# Altium schematic sheet ST-Link Stlink v2_02.SchDoc
size A4
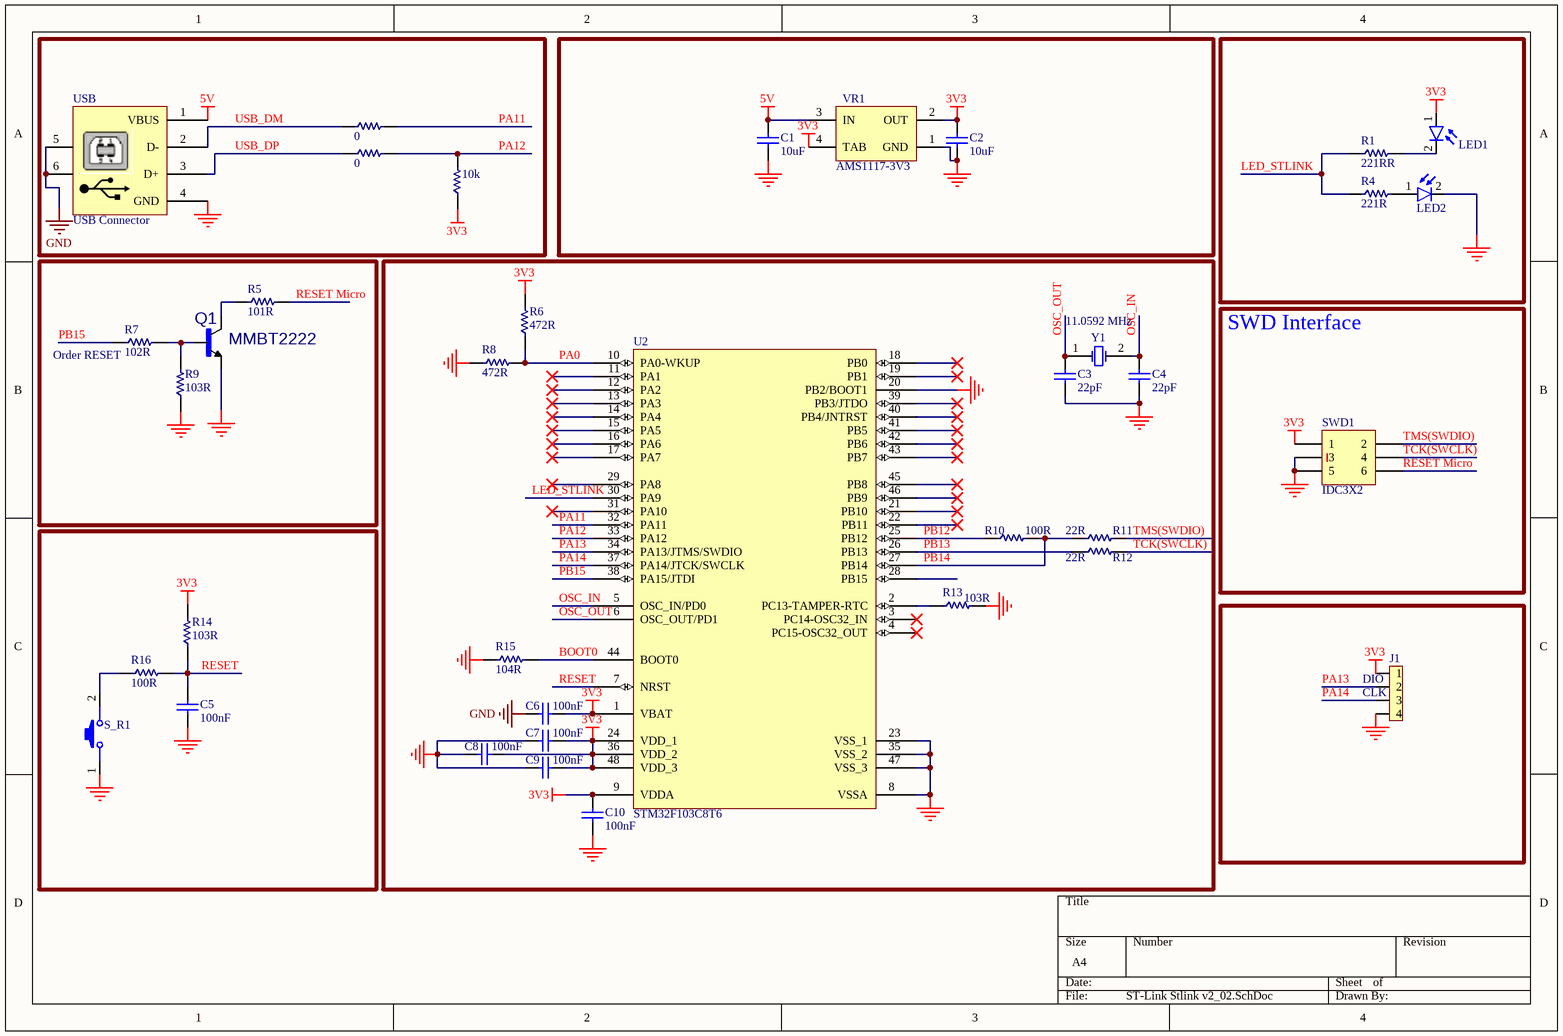
[diagram p0: ST-Link Stlink v2_02.SchDoc]

## Parts
C1  10uF  [CAPC4817X12N]
C2  10uF  [CAPC4817X12N]
C3  22pF  [CAPC4817X12N]
C4  22pF  [CAPC4817X12N]
C5  100nF  [CAPC4817X12N]
C6  100nF  [CAPC4817X12N]
C7  100nF  [CAPC4817X12N]
C8  100nF  [CAPC4817X12N]
C9  100nF  [CAPC4817X12N]
C10  100nF  [CAPC4817X12N]
J1  Program Chip  [ZSIP04]  (value not drawn)
LED1  Color  [LED SMD 1206]  (value not drawn)
LED2  Color  [LED SMD 1206]  (value not drawn)
Q1  MMBT2222  [SOT23_BEC_M]
R1  221RR  [RES1206]
R2  10k  [RES1206]
R4  221R  [RES1206]
R5  101R  [RES1206]
R6  472R  [RES1206]
R7  102R  [RES1206]
R8  472R  [RES1206]
R9  103R  [RES1206]
R10  100R  [RES1206]
R11  22R  [RES1206]
R12  22R  [RES1206]
R13  103R  [RES1206]
R14  103R  [RES1206]
R15  104R  [RES1206]
R16  100R  [RES1206]
R20  0  [RES1206]
R21  0  [RES1206]
S_R1  SW4  [SMD_ALPS_NEW]  (value not drawn)
SWD1  IDC3X2  [IDC_2X3]
U2  STM32F103C8T6  [LQFP48_M]
USB  USB Connector  [USB2.5-2H4F]
VR1  AMS1117-3V3  [MP04A_N]
Y1  11.0592 MHz  [Crystal SMD]

## Blocks framed on the sheet
Order RESET: Q1 R5 R7 R9
SWD Interface: SWD1

## Nets
3V3: C2.2 C6.1 C7.1 C8.1 C9.1 C10.2 J1.1 LED1.1(A) R2.1 R6.2 R14.2 SWD1.1 U2.1(VBAT) U2.9(VDDA) U2.24(VDD_1) U2.36(VDD_2) U2.48(VDD_3) VR1.2(OUT) VR1.4(TAB)
5V: C1.2 USB.1(VBUS) VR1.3(IN)
GND: C1.1 C2.1 C3.1 C4.1 C5.1 C6.2 C7.2 C8.2 C9.2 C10.1 J1.4 LED2.2(K) Q1.2(E) R8.1 R9.1 R13.2 R15.1 S_R1.1(Button) SWD1.3 SWD1.5 U2.8(VSSA) U2.20(PB2/BOOT1) U2.23(VSS_1) U2.35(VSS_2) U2.47(VSS_3) USB.4(GND) USB.5 USB.6 VR1.1(GND)
BOOT0: R15.2 U2.44(BOOT0)
LED_STLINK: R1.1 R4.1 U2.30(PA9)
OSC_IN: C4.2 U2.5(OSC_IN/PD0) Y1.2(OSC2)
OSC_OUT: C3.2 U2.6(OSC_OUT/PD1) Y1.1(OSC1)
PA0: R6.1 R8.2 U2.10(PA0-WKUP)
PA11: R20.2 U2.32(PA11)
PA12: R2.2 R21.2 U2.33(PA12)
PA13: J1.2 U2.34(PA13/JTMS/SWDIO)
PA14: J1.3 U2.37(PA14/JTCK/SWCLK)
PB12: R10.1 U2.25(PB12)
PB13: R12.1 U2.26(PB13)
PB14: R10.2 R11.1 U2.27(PB14)
PB15: R7.1 U2.38(PA15/JTDI)
RESET: C5.2 R14.1 R16.2 U2.7(NRST)
RESET Micro: R5.2 SWD1.6
TCK(SWCLK): R12.2 SWD1.4
TMS(SWDIO): R11.2 SWD1.2
USB_DM: R20.1 USB.2(D-)
USB_DP: R21.1 USB.3(D+)
NetLED1_2: LED1.2(K) R1.2
NetLED2_1: LED2.1(A) R4.2
NetQ1_1: Q1.1(B) R7.2 R9.2
NetQ1_3: Q1.3(C) R5.1
NetR13_1: R13.1 U2.2(PC13-TAMPER-RTC)
NetR16_1: R16.1 S_R1.2

Not connected (* = marked no-connect by the designer): U2 3(PC14-OSC32_IN)* 4(PC15-OSC32_OUT)* 11(PA1)* 12(PA2)* 13(PA3)* 14(PA4)* 15(PA5)* 16(PA6)* 17(PA7)* 18(PB0)* 19(PB1)* 21(PB10)* 22(PB11)* 28(PB15) 29(PA8)* 31(PA10)* 39(PB3/JTDO)* 40(PB4/JNTRST)* 41(PB5)* 42(PB6)* 43(PB7)* 45(PB8)* 46(PB9)*

## Notes on the sheet
- (near J1) DIO
- (near J1) CLK

## Library data of the parts
C1-C10 = CAP SMD 1206: CAP 1206; Designer: Abbas Basereh; Desc.: CAP SMD 1206; Data: 16-12-2016
J1 = ZCON4: Connector
LED1 LED2 = LED: Infra Red Reciever Photo Diode; Designer: Saeid Jorablo; Organazation: ControTec; Adding Date: 1387/12/22
R1 R4-R16 = res
R2 = resistor-smd-1206-10k: manufacture: ANHUI VICO TECHNOLOGIES CO.; manufacture p-n: 10K (1206) 1%; designer: rashid_behdarvand; description: smd-1206-1%; LIBRARY PATCH: R_C_D_T.SchLib; Rahkaran: 1012000582; part: resistor-smd-1206-10k; value: 10k; case: 1206; supplier1: javan; supplier1 p-n: 10K (1206) 1%; Footprint Patch: R_C_D_T.PcbLib
R20 R21 = resistor-smd-1206-0-ohm: manufacture: ITEX; manufacture p-n: 1206W4J0000IT5; designer: rashid_behdarvand; value: 0-ohm; LIBRARY PATCH: R_C_D_T.SchLib; Rahkaran: ‎1012000047; part: resistor-smd-1206-0-ohm; case: 1206; supplier1: javan; supplier1 p-n: 0 (1206); Footprint Patch: R_C_D_T.PcbLib
S_R1 = SW_PB2: 2 Pin Push Button Switch; Company: SJ Libraries; Designer: Eng. Saeid Jorablo; Mounting Technology: Surface Mount\Through-Hole; ComponentLink1Description: Datasheet; Pin Count: 0; Update Date: 6/3/2012; Category: MISC; HelpURL: http://s3.picofile.com/file/7443264187/Coming_Soon_logo.gif
SWD1 = IDC 3X2: IDC, 6-Pin, Dual row; LatestRevisionDate: 17-Jul-2002; LatestRevisionNote: Re-released for DXP Platform.; Publisher: Altium Limited
U2 = STM32F103C8T6: STM32 ARM-based 32-bit MCU with 64 Kbytes Flash, 48-pin LQFP, Industrial Temperature; Published: 30-May-2008; DatasheetVersion: rev6, Mar-2008; PackageVersion: Mar-2008; PackageReference: LQFP48; Publisher: Altium Limited; PackageDescription: 48-Pin Low-Profile Quad Flat Pack, 7 x 7 mm Body, 0.5 mm Pitch (LQFP48); ComponentLink1Description: Manufacturer Link; ComponentLink1URL: www.st.com/stm32; ComponentLink2Description: Datasheet; ComponentLink2URL: http://www.st.com/stonline/products/literature/ds/13587.pdf
USB = USB: USB Connector-B Type; Designer: Eng. Saeid Jorablo; Company: DASE Co; Adding Date: 10/26/2010
VR1 = LM1117IMP-x.x: x.x Volt, 800mA Low-Dropout Linear Regulator, 4-pin SOT-223; PartNumber: LM1117IMP-3.3; Manufacturer: National Semiconductor; PackageTopMarking: XYTT*N05B; PowerWise: N; CompType: LDO IC; Published: 4-Dec-2008; DatasheetVersion: Apr-2006; PackageVersion: revB, Apr-2003; PackageReference: MP04A; Publisher: Altium Limited; PackageDescription: Molded SOT-223, 6.50 x 3.56 x 1.6mm Body, 4 Lead, 2.3mm Pitch; Supplier 1: Farnell; Supplier Part Number 1: 7614123; RoHS: N; PinCount: 4; Code_JEDEC: TO-261-AA; Code_IPC: SOT223-4; ComponentLink1Description: LM1117 Datasheet; ComponentLink1URL: http://www.national.com/ds/LM/LM1117.pdf; ComponentLink2Description: LM1117 Web Page; ComponentLink2URL: http://www.national.com/pf/LM/LM1117.html; ComponentLink3Description: MP04A Package Page; ComponentLink3URL: http://www.national.com/packaging/folders/mp04a.html
Y1 = XTAL: XTAL Crystal; Company: E.P.I.L; Design Date: 11/04/2011; Value: 11.0592 MHz
Q1 = MMBT2222: Value: *